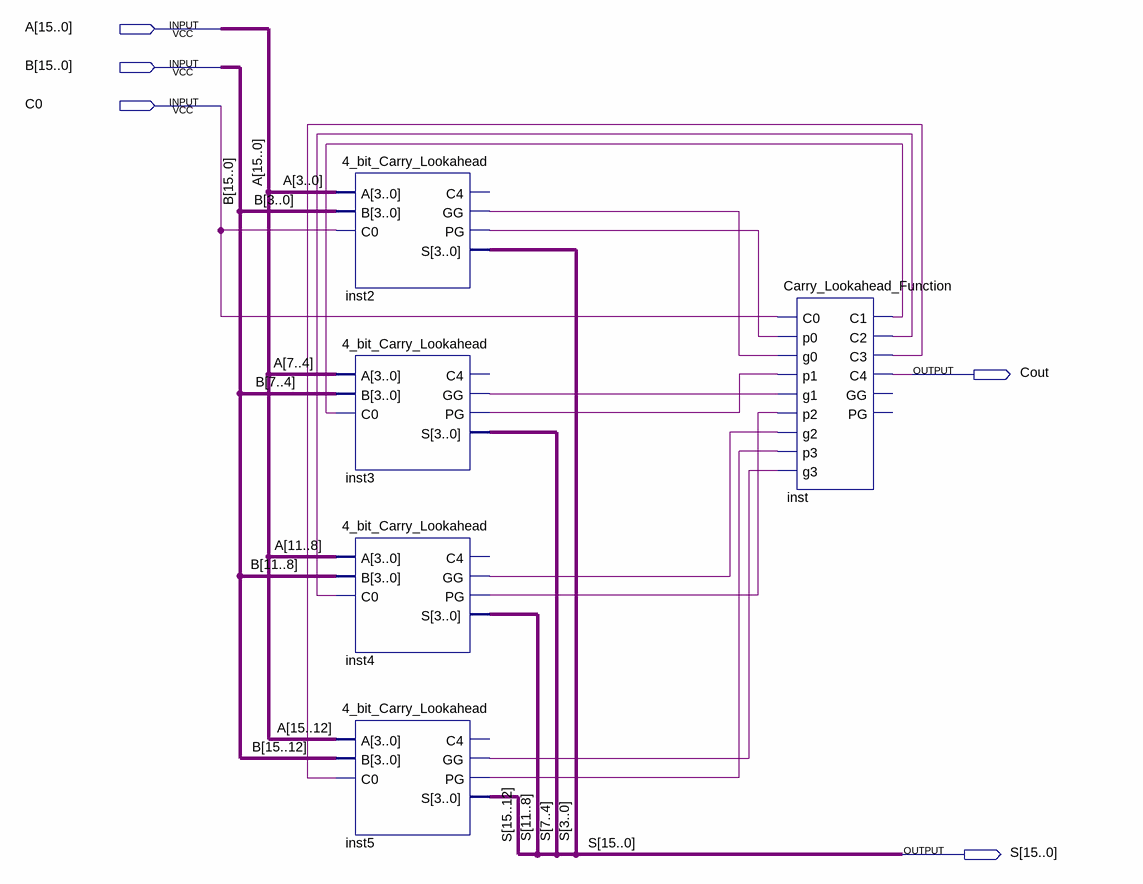
[diagram p0: schematic sheet]
// Quartus schematic 16_bit_Carry_Lookahead.bdf as structural Verilog: 5 symbols, 5 pins
module \16_bit_Carry_Lookahead  (
  input  [15:0] A,
  input  [15:0] B,
  input  C0,
  output Cout,
  output [15:0] S
);

  wire inst2_gg, inst2_pg, inst3_gg, inst3_pg, inst4_gg, inst4_pg, inst5_gg, inst5_pg, inst_c1, inst_c2,
       inst_c3;

  \4_bit_Carry_Lookahead  inst2 (
    .A(A[3:0]), .B(B[3:0]), .C0(C0), .GG(inst2_gg), .PG(inst2_pg), .S(S[3:0]));  // open: C4
  \4_bit_Carry_Lookahead  inst3 (
    .A(A[7:4]), .B(B[7:4]), .C0(inst_c1), .GG(inst3_gg), .PG(inst3_pg), .S(S[7:4]));  // open: C4
  \4_bit_Carry_Lookahead  inst4 (
    .A(A[11:8]), .B(B[11:8]), .C0(inst_c2), .GG(inst4_gg), .PG(inst4_pg), .S(S[11:8]));  // open: C4
  \4_bit_Carry_Lookahead  inst5 (
    .A(A[15:12]), .B(B[15:12]), .C0(inst_c3), .GG(inst5_gg), .PG(inst5_pg), .S(S[15:12]));  // open: C4
  Carry_Lookahead_Function inst (
    .C0(C0), .p0(inst2_pg), .g0(inst2_gg), .p1(inst3_pg), .g1(inst3_gg), .p2(inst4_pg), .g2(inst4_gg),
    .p3(inst5_pg), .g3(inst5_gg), .C1(inst_c1), .C2(inst_c2), .C3(inst_c3), .C4(Cout));  // open: GG, PG
endmodule
